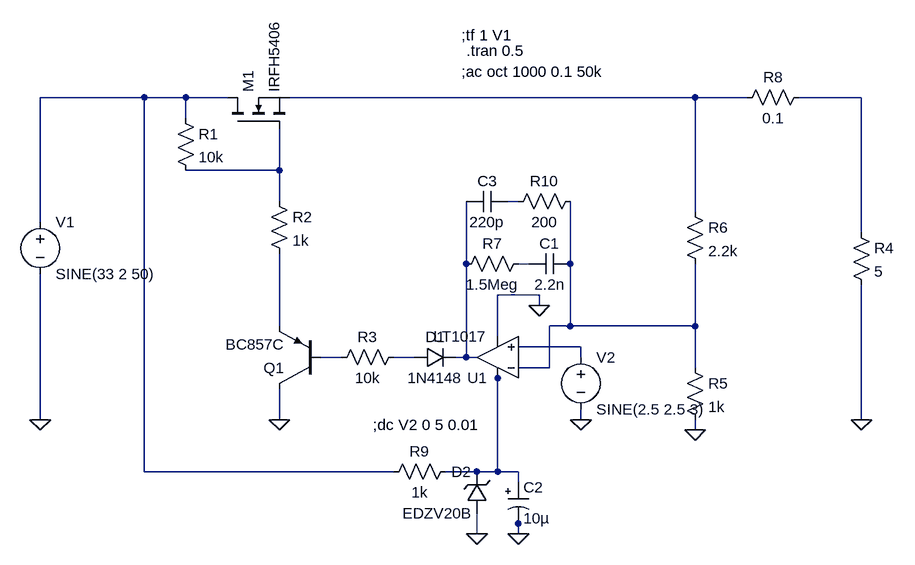
[diagram p0: schematic power.asc]
power.asc, the LTspice schematic file:
Version 4
SHEET 1 1216 772
WIRE -64 80 -224 80
WIRE 0 80 -64 80
WIRE 64 80 0 80
WIRE 784 80 160 80
WIRE 864 80 784 80
WIRE 1040 80 944 80
WIRE 0 112 0 80
WIRE 144 192 144 128
WIRE 144 192 0 192
WIRE 144 240 144 192
WIRE 512 240 496 240
WIRE 784 256 784 80
WIRE -224 272 -224 80
WIRE 1040 288 1040 80
WIRE 432 336 432 240
WIRE 528 336 512 336
WIRE 592 336 592 240
WIRE 544 384 480 384
WIRE 544 400 544 384
WIRE 144 432 144 320
WIRE 592 432 592 336
WIRE 592 432 560 432
WIRE 784 432 784 336
WIRE 784 432 592 432
WIRE 480 448 480 384
WIRE 608 464 512 464
WIRE 240 480 208 480
WIRE 352 480 320 480
WIRE 432 480 432 336
WIRE 432 480 416 480
WIRE 448 480 432 480
WIRE 608 480 608 464
WIRE 560 496 560 432
WIRE 560 496 512 496
WIRE 784 496 784 432
WIRE 480 512 480 496
WIRE -224 576 -224 352
WIRE 144 576 144 528
WIRE 608 576 608 560
WIRE 1040 576 1040 368
WIRE 784 592 784 576
WIRE -64 656 -64 80
WIRE 320 656 -64 656
WIRE 448 656 400 656
WIRE 480 656 480 512
WIRE 480 656 448 656
WIRE 512 656 480 656
WIRE 512 672 512 656
WIRE 512 736 512 720
WIRE 448 752 448 720
WIRE 512 752 512 736
FLAG 144 576 0
FLAG -224 576 0
FLAG 1040 576 0
FLAG 608 576 0
FLAG 544 400 0
FLAG 784 592 0
FLAG 448 752 0
FLAG 512 752 0
SYMBOL res -16 96 R0
SYMATTR InstName R1
SYMATTR Value 10k
SYMBOL res 128 224 R0
SYMATTR InstName R2
SYMATTR Value 1k
SYMBOL pnp 208 528 R180
SYMATTR InstName Q1
SYMATTR Value BC857C
SYMBOL res 336 464 R90
WINDOW 0 0 56 VBottom 2
WINDOW 3 32 56 VTop 2
SYMATTR InstName R3
SYMATTR Value 10k
SYMBOL voltage -224 256 R0
WINDOW 123 24 124 Left 2
WINDOW 39 0 0 Left 2
SYMATTR InstName V1
SYMATTR Value SINE(33 2 50)
SYMBOL res 1024 272 R0
SYMATTR InstName R4
SYMATTR Value 5
SYMBOL voltage 608 464 R0
WINDOW 123 24 124 Left 2
WINDOW 39 0 0 Left 2
SYMATTR InstName V2
SYMATTR Value SINE(2.5 2.5 3)
SYMBOL diode 352 496 R270
WINDOW 0 32 32 VTop 2
WINDOW 3 0 32 VBottom 2
SYMATTR InstName D1
SYMATTR Value 1N4148
SYMBOL nmos 64 128 R270
SYMATTR InstName M1
SYMATTR Value IRFH5406
SYMBOL Comparators\\LT1017 480 480 R180
SYMATTR InstName U1
SYMBOL res 768 480 R0
SYMATTR InstName R5
SYMATTR Value 1k
SYMBOL res 768 240 R0
SYMATTR InstName R6
SYMATTR Value 2.2k
SYMBOL res 528 320 R90
WINDOW 0 0 56 VBottom 2
WINDOW 3 32 56 VTop 2
SYMATTR InstName R7
SYMATTR Value 1.5Meg
SYMBOL cap 592 320 R90
WINDOW 0 0 32 VBottom 2
WINDOW 3 32 32 VTop 2
SYMATTR InstName C1
SYMATTR Value 2.2n
SYMBOL res 960 64 R90
WINDOW 0 0 56 VBottom 2
WINDOW 3 32 56 VTop 2
SYMATTR InstName R8
SYMATTR Value 0.1
SYMBOL res 416 640 R90
WINDOW 0 0 56 VBottom 2
WINDOW 3 32 56 VTop 2
SYMATTR InstName R9
SYMATTR Value 1k
SYMBOL zener 464 720 R180
WINDOW 0 24 64 Left 2
WINDOW 3 24 0 Left 2
SYMATTR InstName D2
SYMATTR Value EDZV20B
SYMBOL polcap 496 672 R0
WINDOW 3 24 56 Left 2
SYMATTR InstName C2
SYMATTR Value 10µ
SYMATTR Description Capacitor
SYMATTR Type cap
SYMATTR SpiceLine V=6.3 Irms=0 Rser=4 Lser=0 mfg="AVX" pn="TAJA106M006" type="Tantalum"
SYMBOL cap 496 224 R90
WINDOW 0 0 32 VBottom 2
WINDOW 3 32 32 VTop 2
SYMATTR InstName C3
SYMATTR Value 220p
SYMBOL res 608 224 R90
WINDOW 0 0 56 VBottom 2
WINDOW 3 32 56 VTop 2
SYMATTR InstName R10
SYMATTR Value 200
TEXT 288 584 Left 2 !;dc V2 0 5 0.01
TEXT 424 40 Left 2 !;ac oct 1000 0.1 50k
TEXT 432 8 Left 2 !.tran 0.5
TEXT 424 -16 Left 2 !;tf 1 V1

The netlist it stands for:
* power.asc
R1 N001 N004 10k
R2 N004 N009 1k
Q1 0 N011 N009 0 BC857C
R3 N012 N011 10k
V1 N001 0 SINE(33 2 50)
R4 N003 0 5
V2 N010 0 SINE(2.5 2.5 3)
D1 N012 N006 1N4148
M1 N001 N004 N002 N002 IRFH5406
XU1 N010 N008 N013 0 N006 LT1017  ; pins In+ In- V+ V- OUT
R5 N008 0 1k
R6 N002 N008 2.2k
R7 N007 N006 1.5Meg
C1 N008 N007 2.2n
R8 N003 N002 0.1
R9 N013 N001 1k
D2 0 N013 EDZV20B
C2 N013 0 10µ V=6.3 Irms=0 Rser=4 Lser=0 mfg="AVX" pn="TAJA106M006" type="Tantalum"
C3 N005 N006 220p
R10 N008 N005 200
.model D D
.lib standard.dio
.model NPN NPN
.model PNP PNP
.lib standard.bjt
.model NMOS NMOS
.model PMOS PMOS
.lib standard.mos
;dc V2 0 5 0.01
;ac oct 1000 0.1 50k
.tran 0.5
;tf 1 V1
.backanno
.end